# Altium project Remoter_12KEY.PrjPCB
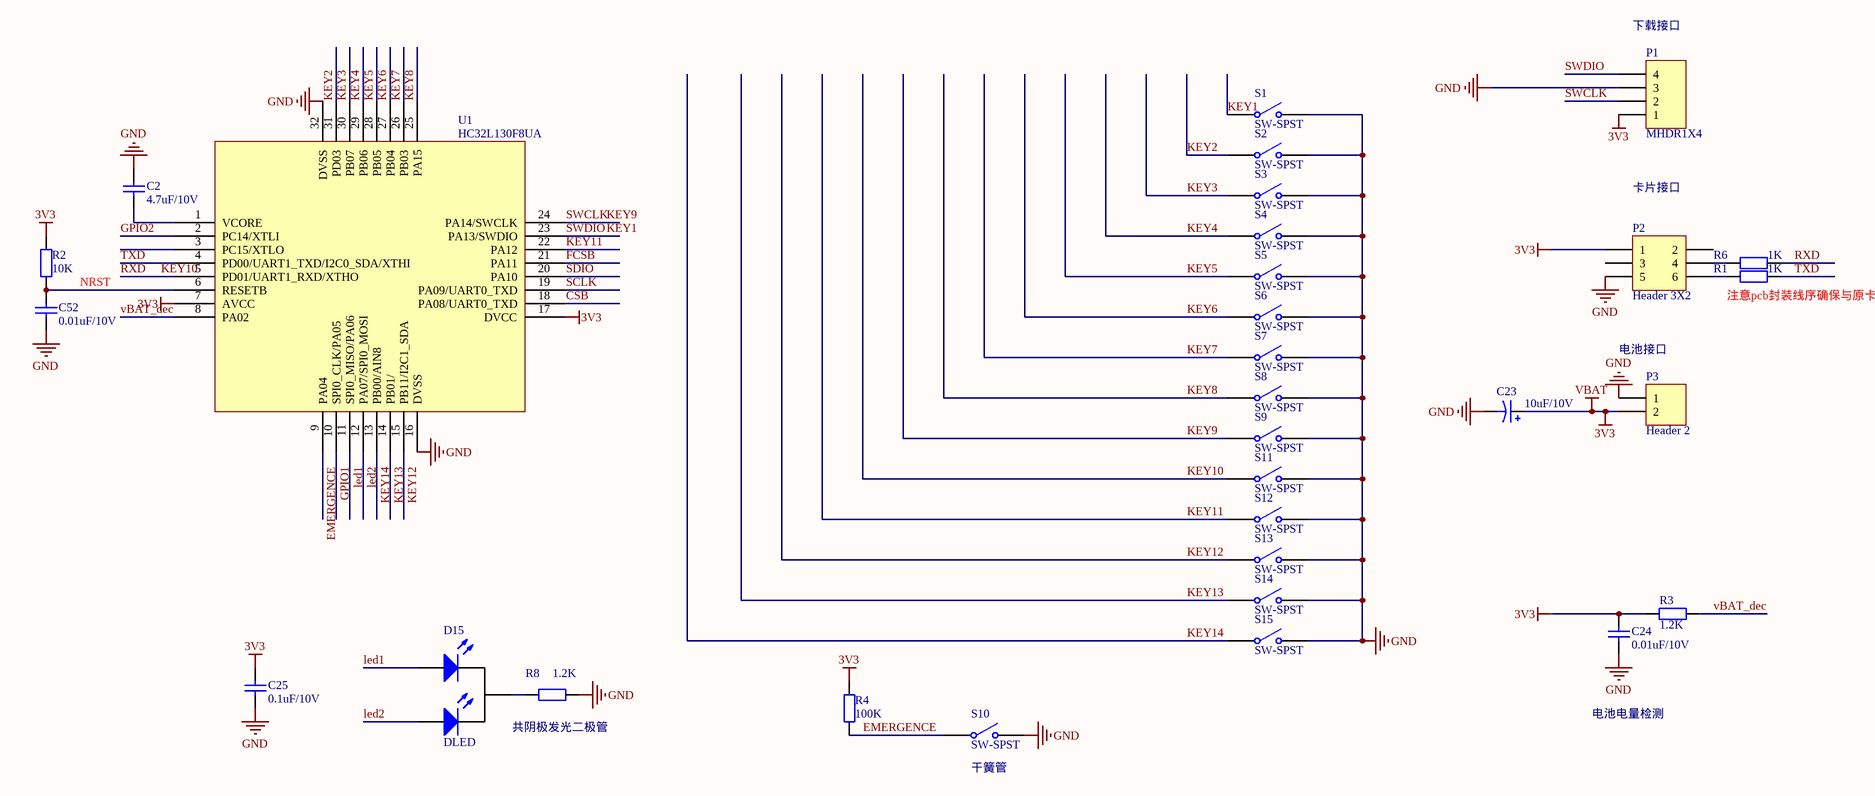
[diagram p0: mcu.SchDoc]
2 sheets, 58 parts. Net scope: global (net labels, ports and power ports of the same name join across sheets).
Sheets:
  mcu.SchDoc
  RF.SchDoc

## Sheet mcu.SchDoc
size A3

### Parts
C2  4.7uF/10V  [0603C]
C23  10uF/10V
C24  0.01uF/10V  [0603C]
C25  0.1uF/10V  [0603C]
C52  0.01uF/10V  [0603C]
D15  DLED
P1  MHDR1X4  [SIP4]
P2  Header 3X2
P3  Header 2
R1  1K  [0603R]
R2  10K  [0603R]
R3  1.2K  [0603R]
R4  100K  [0603R]
R6  1K  [0603R]
R8  1.2K  [0603R]
S1  SW-SPST
S2  SW-SPST
S3  SW-SPST
S4  SW-SPST
S5  SW-SPST
S6  SW-SPST
S7  SW-SPST
S8  SW-SPST
S9  SW-SPST
S10  SW-SPST
S11  SW-SPST
S12  SW-SPST
S13  SW-SPST
S14  SW-SPST
S15  SW-SPST
U1  HC32L130F8UA  [QFN40P400X400X80-32N]

### Nets
3V3: C23.1 C24.1 C25.1 P1.1 P2.1 P3.2 R2.2 R3.2 R4.1 U1.7(AVCC) U1.17(DVCC)  [also labelled VBAT]
GND: C2.1 C23.2 C24.2 C25.2 C52.2 P1.3 P2.5 P3.1 R8.1 S1.2(NO) S2.2(NO) S3.2(NO) S4.2(NO) S5.2(NO) S6.2(NO) S7.2(NO) S8.2(NO) S9.2(NO) S10.2(NO) S11.2(NO) S12.2(NO) S13.2(NO) S14.2(NO) S15.2(NO) U1.16(DVSS) U1.32(DVSS)
CSB: U1.18(PA08/UART0_TXD)
EMERGENCE: R4.2 S10.1(COMMON) U1.9(PA04)
FCSB: U1.21(PA11)
GPIO1: U1.10(SPI0_CLK/PA05)
GPIO2: U1.2(PC14/XTLI)
KEY1: P1.4 S1.1(COMMON) U1.23(PA13/SWDIO)  [also labelled SWDIO]
KEY2: S2.1(COMMON) U1.31(PD03)
KEY3: S3.1(COMMON) U1.30(PB07)
KEY4: S4.1(COMMON) U1.29(PB06)
KEY5: S5.1(COMMON) U1.28(PB05)
KEY6: S6.1(COMMON) U1.27(PB04)
KEY7: S7.1(COMMON) U1.26(PB03)
KEY8: S8.1(COMMON) U1.25(PA15)
KEY9: P1.2 S9.1(COMMON) U1.24(PA14/SWCLK)  [also labelled SWCLK]
KEY10: R6.1 S11.1(COMMON) U1.5(PD01/UART1_RXD/XTHO)  [also labelled RXD]
KEY11: S12.1(COMMON) U1.22(PA12)
KEY12: S13.1(COMMON) U1.15(PB11/I2C1_SDA)
KEY13: S14.1(COMMON) U1.14(PB01/)
KEY14: S15.1(COMMON) U1.13(PB00/AIN8)
led1: D15.1(A) U1.11(SPI0_MISO/PA06)
led2: D15.3(A) U1.12(PA07/SPI0_MOSI)
NRST: C52.1 R2.1 U1.6(RESETB)
SCLK: U1.19(PA09/UART0_TXD)
SDIO: U1.20(PA10)
TXD: R1.1 U1.4(PD00/UART1_TXD/I2C0_SDA/XTHI)
vBAT_dec: R3.1 U1.8(PA02)
NetC2_2: C2.2 U1.1(VCORE)
NetD15_2: D15.2(K) R8.2
NetP2_4: P2.4 R6.2
NetP2_6: P2.6 R1.2

Not connected (* = marked no-connect by the designer): P2 2 3; U1 3(PC15/XTLO)

### Notes on the sheet
- (near P1) 下载接口
- 卡片接口
- (near R1) 注意pcb封装线序确保与原卡片接口一致
- (near P3) 电池接口
- 共阴极发光二极管
- 电池电量检测
- (near S10) 干簧管

### Library data of the parts
C2 C24 C25 C52 = Cap: Capacitor; Value: 106; Published: 8-Jun-2000; LatestRevisionDate: 17-Jul-2002; LatestRevisionNote: Re-released for DXP Platform.; PackageReference: RAD-0.3; Publisher: Altium Limited
C23 = Cap Pol1: Polarized Capacitor (Radial); Value: 100pF; Published: 8-Jun-2000; LatestRevisionDate: 17-Jul-2002; LatestRevisionNote: Re-released for DXP Platform.; PackageReference: RB7.6-15; Publisher: Altium Limited
P1 = MHDR1X4: Header, 4-Pin; LatestRevisionDate: 17-Jul-2002; LatestRevisionNote: Re-released for DXP Platform.; Publisher: Altium Limited
P2 = Header 3X2: Header, 3-Pin, Dual row; LatestRevisionDate: 17-Jul-2002; LatestRevisionNote: Re-released for DXP Platform.; Publisher: Altium Limited
P3 = Header 2: Header, 2-Pin; LatestRevisionDate: 17-Jul-2002; LatestRevisionNote: Re-released for DXP Platform.; Publisher: Altium Limited
R1-R4 R6 R8 = Res2: Resistor; Value: 10K/5%/1/8W; Published: 8-Jun-2000; LatestRevisionDate: 17-Jul-2002; LatestRevisionNote: Re-released for DXP Platform.; PackageReference: AXIAL-0.4; Publisher: Altium Limited
S1-S15 = SW-SPST: Single-Pole, Single-Throw Switch; Published: 24-Mar-1999; LatestRevisionDate: 17-Jul-2002; LatestRevisionNote: Re-released for DXP Platform.; PackageReference: SPST-2; Publisher: Altium Limited

## Sheet RF.SchDoc
size A3
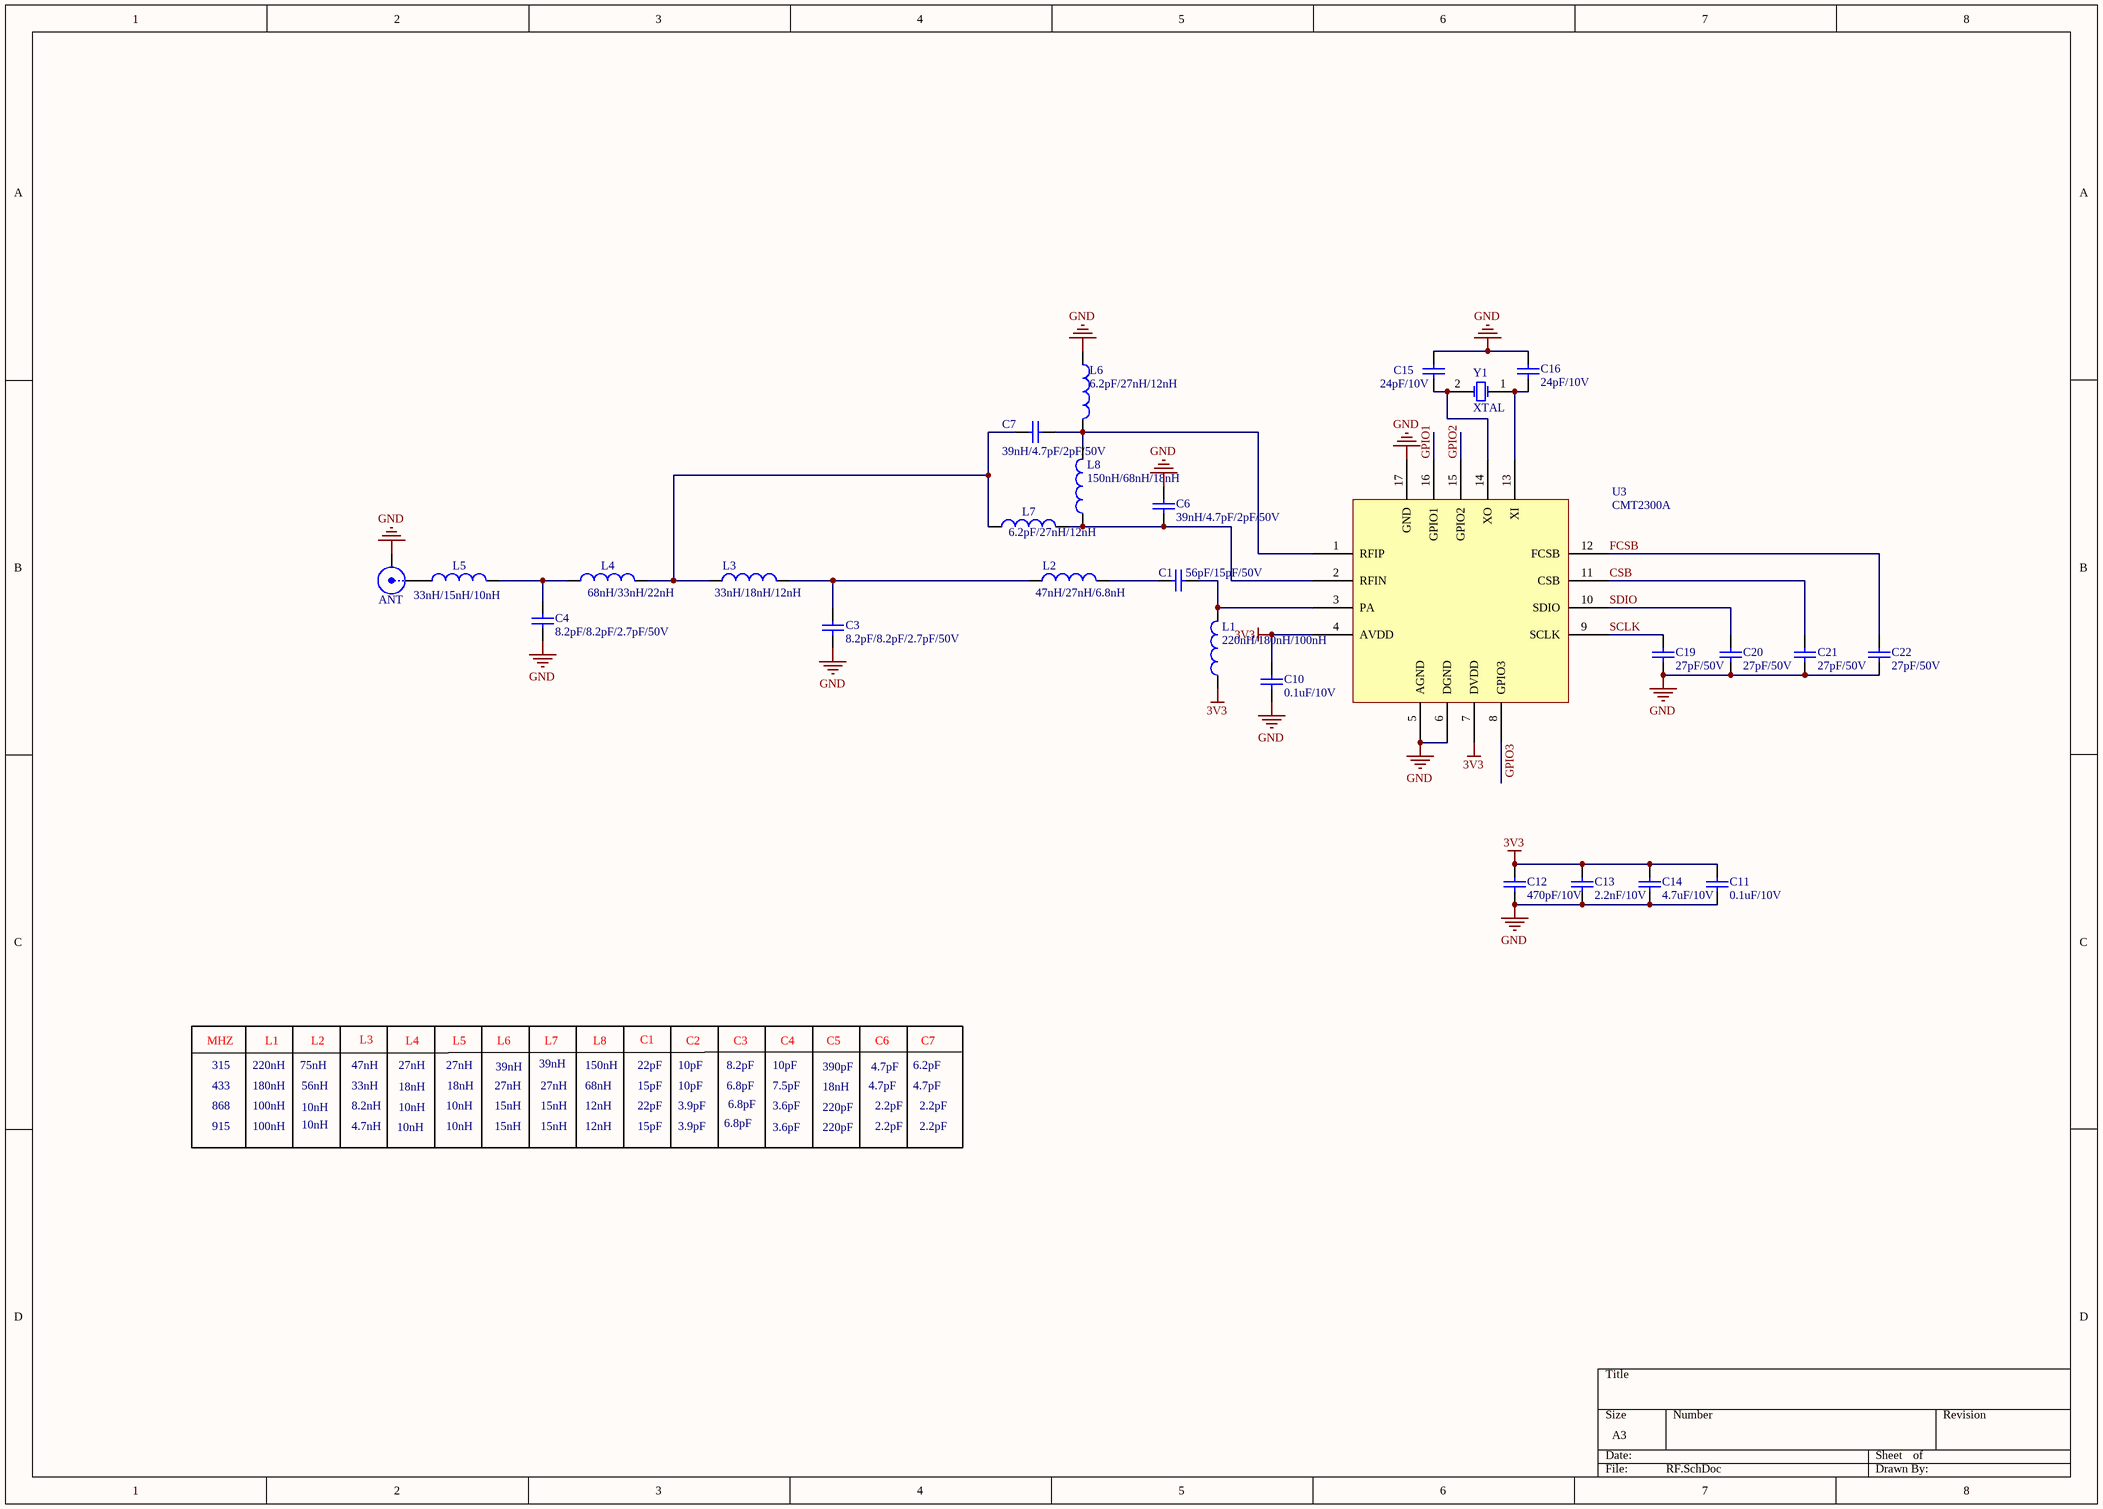
[diagram p1: RF.SchDoc]

### Parts
ANT  (no value)  [SMA Straight SMD]
C1  56pF/15pF/50V  [0603C]
C3  8.2pF/8.2pF/2.7pF/50V  [0603C]
C4  8.2pF/8.2pF/2.7pF/50V  [0603C]
C6  39nH/4.7pF/2pF/50V  [0603C]
C7  39nH/4.7pF/2pF/50V  [0603C]
C10  0.1uF/10V  [0603C]
C11  0.1uF/10V  [0603C]
C12  470pF/10V  [0603C]
C13  2.2nF/10V  [0603C]
C14  4.7uF/10V  [0603C]
C15  24pF/10V  [0603C]
C16  24pF/10V  [0603C]
C19  27pF/50V  [0603C]
C20  27pF/50V  [0603C]
C21  27pF/50V  [0603C]
C22  27pF/50V  [0603C]
L1  220nH/180nH/100nH  [0603R]
L2  47nH/27nH/6.8nH  [0603R]
L3  33nH/18nH/12nH  [0603R]
L4  68nH/33nH/22nH  [0603R]
L5  33nH/15nH/10nH  [0603R]
L6  6.2pF/27nH/12nH  [0603R]
L7  6.2pF/27nH/12nH  [0603R]
L8  150nH/68nH/18nH  [0603R]
U3  CMT2300A
Y1  XTAL  [BCY-W2/D3.1]

### Nets
3V3: C10.1 C11.1 C12.1 C13.1 C14.1 L1.1 U3.4(AVDD) U3.7(DVDD)
GND: ANT.2(GND) C3.2 C4.2 C6.2 C10.2 C11.2 C12.2 C13.2 C14.2 C15.1 C16.1 C19.2 C20.2 C21.2 C22.2 L6.1 U3.5(AGND) U3.6(DGND) U3.17(GND)
CSB: C21.1 U3.11(CSB)
FCSB: C22.1 U3.12(FCSB)
GPIO1: U3.16(GPIO1)
GPIO2: U3.15(GPIO2)
GPIO3: U3.8(GPIO3)
SCLK: C19.1 U3.9(SCLK)
SDIO: C20.1 U3.10(SDIO)
NetANT_1: ANT.1(Signal) L5.1
NetC1_1: C1.1 L2.2
NetC1_2: C1.2 L1.2 U3.3(PA)
NetC3_1: C3.1 L2.1 L3.2
NetC4_1: C4.1 L4.1 L5.2
NetC6_1: C6.1 L7.2 L8.1 U3.2(RFIN)
NetC7_1: C7.1 L3.1 L4.2 L7.1
NetC7_2: C7.2 L6.2 L8.2 U3.1(RFIP)
NetC15_2: C15.2 U3.14(XO) Y1.2(OSC2)
NetC16_2: C16.2 U3.13(XI) Y1.1(OSC1)

### Notes on the sheet
- MHZ
- L1
- L2
- L3
- L4
- L5
- L6
- L7
- L8
- C1
- C2
- C3
- C4
- C5
- C6
- C7
- 315
- 433
- 868
- 220nH
- 180nH
- 100nH
- 75nH
- 56nH
- 10nH
- 47nH
- 33nH
- 8.2nH
- 27nH
- 18nH
- 15nH
- 39nH
- 150nH
- 68nH
- 12nH
- 22pF
- 15pF
- 10pF
- 3.9pF
- 6.8pF
- 8.2pF
- 7.5pF
- 3.6pF
- 390pF
- 220pF
- 4.7pF
- 2.2pF
- 6.2pF
- 915
- 4.7nH

### Library data of the parts
ANT = SMA: SMA Straight Connector; LatestRevisionDate: 05-oct-2007  -  Semtech; LatestRevisionNote: Re-released for DXP Platform.; Publisher: Altium Limited
C1 C3 C4 C6 C7 C10-C16 C19-C22 = Cap: Capacitor; Value: 106; Published: 8-Jun-2000; LatestRevisionDate: 17-Jul-2002; LatestRevisionNote: Re-released for DXP Platform.; PackageReference: RAD-0.3; Publisher: Altium Limited
L1-L8 = Inductor: Code_IEC: 1005; Value: 10mH; Published: 8-Jun-2000; LatestRevisionDate: 29-May-2009; LatestRevisionNote: IPC-7351 Footprint Added.; PackageReference: 0402-A; Publisher: Altium Limited; PackageDescription: Chip Inductor; Code_JEITA: 0402
Y1 = XTAL: Crystal Oscillator; Published: 8-Jun-2000; LatestRevisionDate: 17-Jul-2002; LatestRevisionNote: Re-released for DXP Platform.; PackageReference: R38; Publisher: Altium Limited

## Nets that join several sheets
3V3: mcu (11 pins), RF (8 pins)
GND: mcu (26 pins), RF (19 pins)
CSB: mcu (U1.18), RF (C21.1 U3.11)
FCSB: mcu (U1.21), RF (C22.1 U3.12)
GPIO1: mcu (U1.10), RF (U3.16)
GPIO2: mcu (U1.2), RF (U3.15)
SCLK: mcu (U1.19), RF (C19.1 U3.9)
SDIO: mcu (U1.20), RF (C20.1 U3.10)